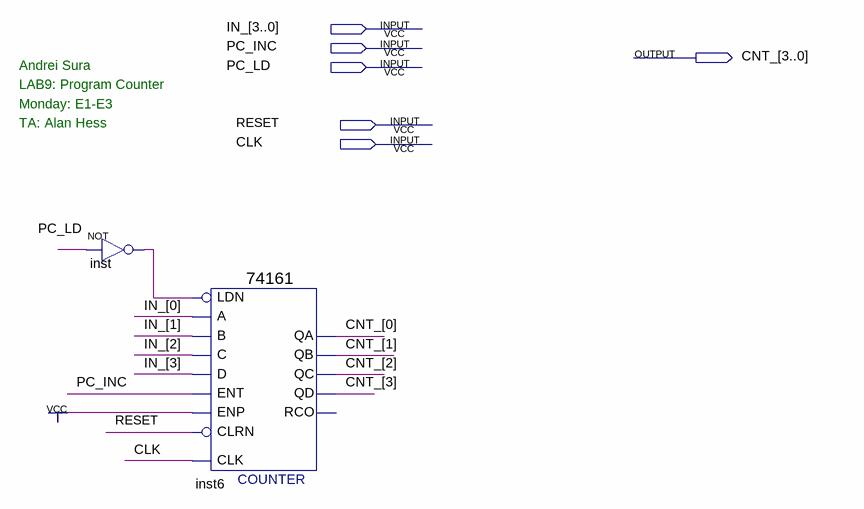
[diagram p0: schematic sheet]
// Quartus schematic prog_counter.bdf as structural Verilog: 2 symbols, 6 pins
module prog_counter (
  input  [3:0] IN_,
  input  PC_INC,
  input  PC_LD,
  input  RESET,
  input  CLK,
  output [3:0] CNT_
);

  wire inst_out;

  not inst (inst_out, PC_LD);
  \74161  inst6 (
    .CLRN(RESET), .CLK(CLK), .ENP(1'b1), .LDN(inst_out), .A(IN_[0]), .D(IN_[3]), .ENT(PC_INC), .B(IN_[1]),
    .C(IN_[2]), .QD(CNT_[3]), .QC(CNT_[2]), .QB(CNT_[1]), .QA(CNT_[0]));  // open: RCO

  // Notes on the sheet:
  //   Andrei Sura
  //   LAB9: Program Counter
  //   Monday: E1-E3
  //   TA: Alan Hess
endmodule
